# Altium project PCB_Project1.PrjPCB
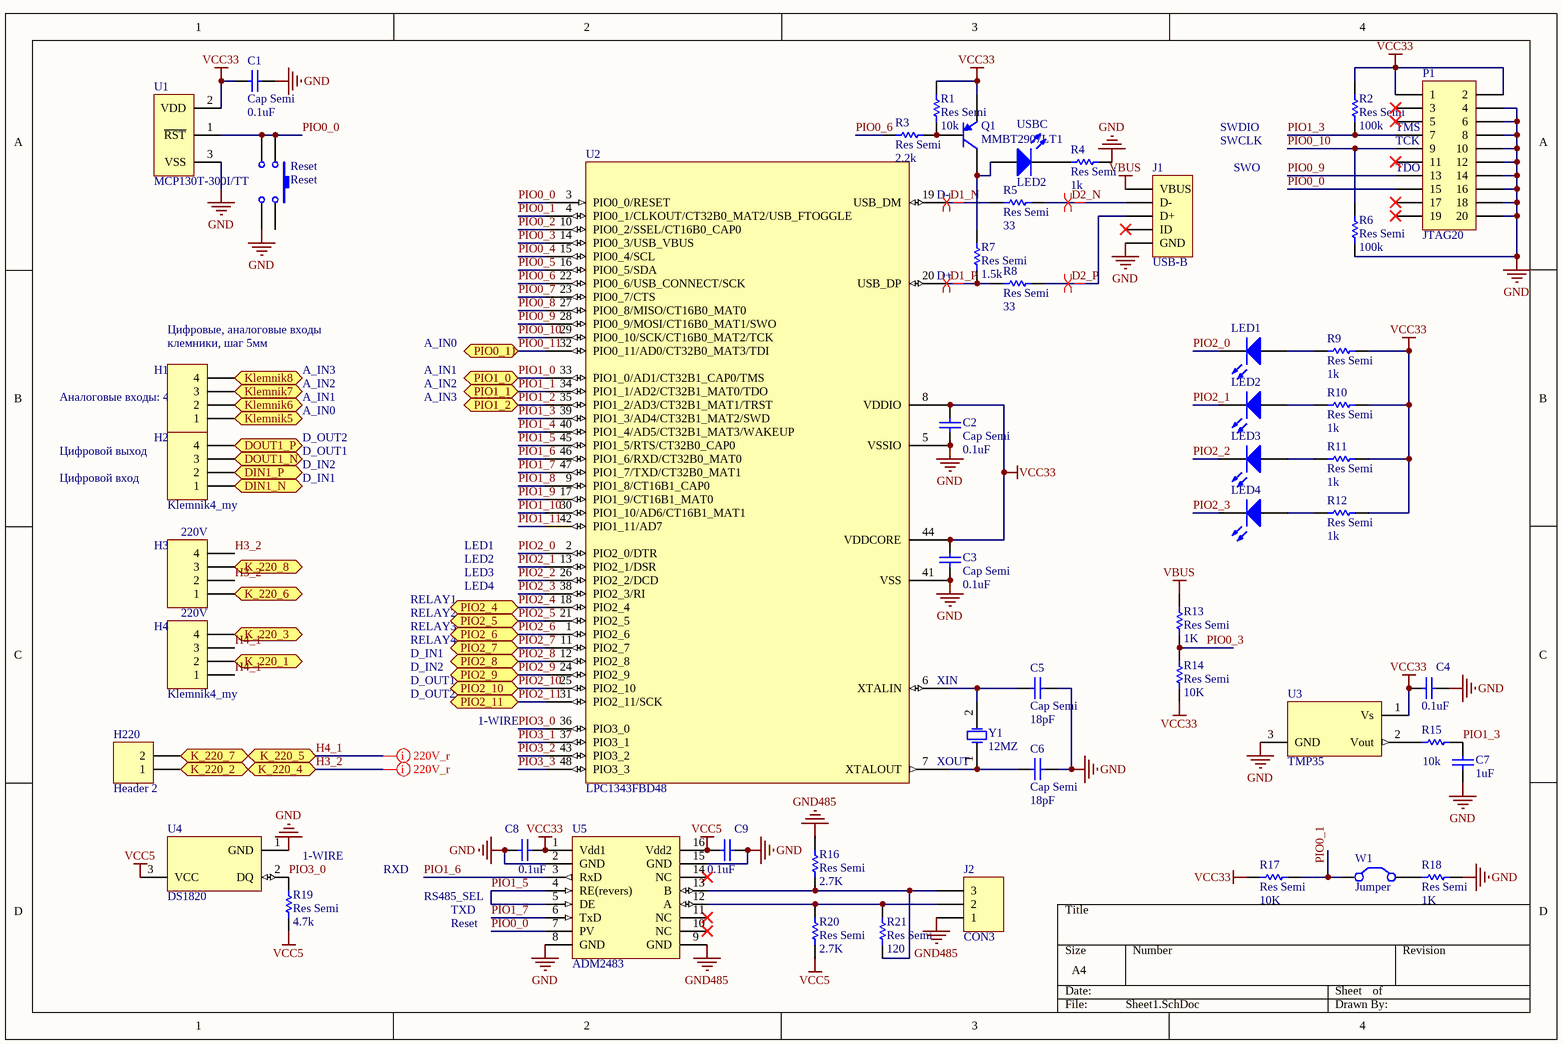
[diagram p0: Sheet1.SchDoc]
2 sheets, 99 parts. Net scope: flat (ports and power ports of the same name join across sheets).
Board files: PCB1.PcbDoc, PCB2.PcbDoc
Sheets:
  Sheet1.SchDoc
  Slave_Sheet2.SchDoc

## Sheet Sheet1.SchDoc
size A4

### Parts
C1  Cap Semi  value 0.1uF  [CAPC2012M]
C2  Cap Semi  value 0.1uF  [CAPC2012M]
C3  Cap Semi  value 0.1uF  [CAPC2012M]
C4  value 0.1uF  [CAPC2012M]  (hidden comment: Cap Semi)
C5  Cap Semi  value 18pF  [CAPC2012M]
C6  Cap Semi  value 18pF  [CAPC2012M]
C7  value 1uF  [CAPC2012M]  (hidden comment: Cap Semi)
C8  value 0.1uF  [CAPC2012M]  (hidden comment: Cap Semi)
C9  value 0.1uF  [CAPC2012M]  (hidden comment: Cap Semi)
H1  Klemnik4_my  [Klemnik4_5mm]  (value not drawn)
H2  Klemnik4_my  [Klemnik4_5mm]
H3  Klemnik4_my  [Klemnik4_5mm]  (value not drawn)
H4  Klemnik4_my  [Klemnik4_5mm]
H220  Header 2  [Klemnik2_5mm]
J1  USB-B  [MINI USB]
J2  CON3  [Klemnik3_5mm]
LED1  LED2  [CD3216-1206]  (value not drawn)
LED2  LED2  [CD3216-1206]  (value not drawn)
LED3  LED2  [CD3216-1206]  (value not drawn)
LED4  LED2  [CD3216-1206]  (value not drawn)
P1  JTAG20  [JTAG_SWD_2.54]
Q1  MMBT2907LT1  [SOT23_M]
R1  Res Semi  value 10k  [RESC2012M]
R2  Res Semi  value 100k  [RESC2012M]
R3  Res Semi  value 2.2k  [RESC2012M]
R4  Res Semi  value 1k  [RESC2012M]
R5  Res Semi  value 33  [RESC2012M]
R6  Res Semi  value 100k  [RESC2012M]
R7  Res Semi  value 1.5k  [RESC2012M]
R8  Res Semi  value 33  [RESC2012M]
R9  Res Semi  value 1k  [RESC2012M]
R10  Res Semi  value 1k  [RESC2012M]
R11  Res Semi  value 1k  [RESC2012M]
R12  Res Semi  value 1k  [RESC2012M]
R13  Res Semi  value 1K  [RESC2012M]
R14  Res Semi  value 10K  [RESC2012M]
R15  value 10k  [RESC2012M]  (hidden comment: Res Semi)
R16  Res Semi  value 2.7K  [RESC2012M]
R17  Res Semi  value 10K  [RESC2012M]
R18  Res Semi  value 1K  [RESC2012M]
R19  Res Semi  value 4.7k  [RESC2012M]
R20  Res Semi  value 2.7K  [RESC2012M]
R21  Res Semi  value 120  [RESC2012M]
Reset  Reset  [BUTTON]
U1  MCP130T-300I/TT  [SOT-23-TT3_N]
U2  LPC1343FBD48  [LQFP48_L]
U3  TMP35  [PR35]
U4  DS1820  [PR35]
U5  ADM2483  [SO16_N]
USBC  LED2  [CD3216-1206]
W1  Jumper  [HDR1X2]
Y1  12MZ  [HC-49SM]

### Ports
DIN1_N (bidir), DIN1_P (bidir), DOUT1_N (bidir), DOUT1_P (bidir), K_220_1 (bidir), K_220_2 (bidir), K_220_3 (bidir), K_220_4 (bidir), K_220_5 (bidir), K_220_6 (bidir), K_220_7 (bidir), K_220_8 (bidir), Klemnik5 (bidir), Klemnik6 (bidir), Klemnik7 (bidir), Klemnik8 (bidir), PIO0_11 (bidir), PIO1_0 (bidir), PIO1_1 (bidir), PIO1_2 (bidir), PIO2_4 (bidir), PIO2_5 (bidir), PIO2_6 (bidir), PIO2_7 (bidir), PIO2_8 (bidir), PIO2_9 (bidir), PIO2_10 (bidir), PIO2_11 (bidir)

### Nets
GND: C1.1 C2.1 C3.1 C4.1 C5.1 C6.1 C7.1 C8.2 C9.1 J1.5(GND) P1.4 P1.6 P1.8 P1.10 P1.12 P1.14 P1.16 P1.18 P1.20 R4.1 R6.2 R18.1 Reset.2 U1.3(VSS) U2.5(VSSIO) U2.41(VSS) U3.3(GND) U4.1(GND) U5.2(GND) U5.8(GND) U5.15(GND)
GND485: J2.1 R16.2 U5.9(GND)
VBUS: J1.1(VBUS) R13.2
VCC5: C9.2 R19.2 R20.1 U4.3(VCC) U5.16(Vdd2)
VCC33: C1.2 C2.2 C3.2 C4.2 C8.1 P1.1 P1.2 Q1.2(E) R1.2 R2.1 R9.1 R10.1 R11.2 R12.1 R14.1 R17.2 U1.2(VDD) U2.8(VDDIO) U2.44(VDDCORE) U3.1(Vs) U5.1(Vdd1)
D1_N: R5.1 U2.19(USB_DM)
D1_P: R7.1 R8.1 U2.20(USB_DP)
D2_N: J1.2(D-) R5.2
D2_P: J1.3(D+) R8.2
H3_2: H3.2 H3.4 H220.1 ; port K_220_4, port K_220_2
H4_1: H4.1 H4.3 H220.2 ; port K_220_5, port K_220_7
PIO0_0: P1.15 Reset.3 Reset.4 U1.1(~{RST}) U2.3(PIO0_0/RESET) U5.7(PV)
PIO0_1: R17.1 U2.4(PIO0_1/CLKOUT/CT32B0_MAT2/USB_FTOGGLE) W1.1(C1)
PIO0_2: U2.10(PIO0_2/SSEL/CT16B0_CAP0)
PIO0_3: R13.1 R14.2 U2.14(PIO0_3/USB_VBUS)
PIO0_4: U2.15(PIO0_4/SCL)
PIO0_5: U2.16(PIO0_5/SDA)
PIO0_6: R3.2 U2.22(PIO0_6/USB_CONNECT/SCK)
PIO0_7: U2.23(PIO0_7/CTS)
PIO0_8: U2.27(PIO0_8/MISO/CT16B0_MAT0)
PIO0_9: P1.13 U2.28(PIO0_9/MOSI/CT16B0_MAT1/SWO)
PIO0_10: P1.9 R6.1 U2.29(PIO0_10/SCK/CT16B0_MAT2/TCK)
PIO0_11: U2.32(PIO0_11/AD0/CT32B0_MAT3/TDI) ; port PIO0_11
PIO1_0: U2.33(PIO1_0/AD1/CT32B1_CAP0/TMS) ; port PIO1_0
PIO1_1: U2.34(PIO1_1/AD2/CT32B1_MAT0/TDO) ; port PIO1_1
PIO1_2: U2.35(PIO1_2/AD3/CT32B1_MAT1/TRST) ; port PIO1_2
PIO1_3: C7.2 P1.7 R2.2 R15.1 U2.39(PIO1_3/AD4/CT32B1_MAT2/SWD)
PIO1_4: U2.40(PIO1_4/AD5/CT32B1_MAT3/WAKEUP)
PIO1_5: U2.45(PIO1_5/RTS/CT32B0_CAP0) U5.4(RE(revers)) U5.5(DE)
PIO1_6: U2.46(PIO1_6/RXD/CT32B0_MAT0) U5.3(RxD)
PIO1_7: U2.47(PIO1_7/TXD/CT32B0_MAT1) U5.6(TxD)
PIO1_8: U2.9(PIO1_8/CT16B1_CAP0)
PIO1_9: U2.17(PIO1_9/CT16B1_MAT0)
PIO1_10: U2.30(PIO1_10/AD6/CT16B1_MAT1)
PIO1_11: U2.42(PIO1_11/AD7)
PIO2_0: LED1.2(K) U2.2(PIO2_0/DTR)
PIO2_1: LED2.2(K) U2.13(PIO2_1/DSR)
PIO2_2: LED3.2(K) U2.26(PIO2_2/DCD)
PIO2_3: LED4.2(K) U2.38(PIO2_3/RI)
PIO2_4: U2.18(PIO2_4) ; port PIO2_4
PIO2_5: U2.21(PIO2_5) ; port PIO2_5
PIO2_6: U2.1(PIO2_6) ; port PIO2_6
PIO2_7: U2.11(PIO2_7) ; port PIO2_7
PIO2_8: U2.12(PIO2_8) ; port PIO2_8
PIO2_9: U2.24(PIO2_9) ; port PIO2_9
PIO2_10: U2.25(PIO2_10) ; port PIO2_10
PIO2_11: U2.31(PIO2_11/SCK) ; port PIO2_11
PIO3_0: R19.1 U2.36(PIO3_0) U4.2(DQ)
PIO3_1: U2.37(PIO3_1)
PIO3_2: U2.43(PIO3_2)
PIO3_3: U2.48(PIO3_3)
NetC5_2: C5.2 U2.6(XTALIN) Y1.2(OSC2)
NetC6_2: C6.2 U2.7(XTALOUT) Y1.1(OSC1)
NetH1_1: H1.1 ; port Klemnik5
NetH1_2: H1.2 ; port Klemnik6
NetH1_3: H1.3 ; port Klemnik7
NetH1_4: H1.4 ; port Klemnik8
NetH2_1: H2.1 ; port DIN1_N
NetH2_2: H2.2 ; port DIN1_P
NetH2_3: H2.3 ; port DOUT1_N
NetH2_4: H2.4 ; port DOUT1_P
NetH3_1: H3.1 ; port K_220_6
NetH3_3: H3.3 ; port K_220_8
NetH4_2: H4.2 ; port K_220_1
NetH4_4: H4.4 ; port K_220_3
NetJ2_2: J2.2 R20.2 R21.2 U5.12(A)
NetJ2_3: J2.3 R16.1 R21.1 U5.13(B)
NetLED1_1: LED1.1(A) R9.2
NetLED2_1: LED2.1(A) R10.2
NetLED3_1: LED3.1(A) R11.1
NetLED4_1: LED4.1(A) R12.2
NetQ1_1: Q1.1(B) R1.1 R3.1
NetQ1_3: Q1.3(C) R7.2 USBC.1(A)
NetR4_2: R4.2 USBC.2(K)
NetR15_2: R15.2 U3.2(Vout)
NetR18_2: R18.2 W1.2(C2)

Not connected (* = marked no-connect by the designer): J1 4(ID)*; P1 3* 5* 11* 17* 19*; Reset 1; U5 10(NC)* 11(NC)* 14(NC)*

### Layout directives
differential pair: D1_N, D1_P, D2_N, D2_P
net class 220V_r: H3_2, H4_1

### Notes on the sheet
- SWDIO
- SWCLK
- SWO
- (near P1) TMS
- (near P1) TCK
- (near P1) TDO
- D-
- D+
- (near H1) клемники, шаг 5мм
- (near H1) Цифровые, аналоговые входы
- A_IN2
- A_IN3
- A_IN1
- A_IN0
- Аналоговые входы: 4
- Цифровой выход
- D_OUT1
- D_OUT2
- Цифровой вход
- D_IN1
- D_IN2
- (near H3) 220V
- LED4
- LED1
- LED2
- LED3
- 220V
- RELAY1
- RELAY2
- RELAY3
- RELAY4
- 1-WIRE
- (near U2) XIN
- XOUT
- RXD
- RS485_SEL
- TXD
- Reset

### Library data of the parts
C1-C9 = Cap Semi: Capacitor (Semiconductor SIM Model); Published: 8-Jun-2000; LatestRevisionDate: 29-May-2009; LatestRevisionNote: IPC-7351 Footprint Added.; PackageReference: C1206; Publisher: Altium Limited; PackageDescription: Chip Capacitor
H1-H4 = Klemnik4_my: Header, 4-Pin, 300-041-12; LatestRevisionDate: 17-Jul-2002; LatestRevisionNote: Re-released for DXP Platform.; Publisher: Altium Limited
H220 = Header 2: Header, 2-Pin; LatestRevisionDate: 17-Jul-2002; LatestRevisionNote: Re-released for DXP Platform.; Publisher: Altium Limited
J1 = USB connector 5: USB connector, 5-Pin; LatestRevisionDate: 17-Jul-2002; LatestRevisionNote: Re-released for DXP Platform.; Publisher: Altium Limited
J2 = RS485 Klemnik 3: Header, 3-Pin; LatestRevisionDate: 17-Jul-2002; LatestRevisionNote: Re-released for DXP Platform.; Publisher: Altium Limited
LED1-LED4 USBC = LED2: Typical RED, GREEN, YELLOW, AMBER GaAs LED; Published: 8-Jun-2000; LatestRevisionDate: 17-Jul-2002; LatestRevisionNote: Re-released for DXP Platform.; PackageVersion: Feb-2002; PackageReference: 3.2X1.6X1.1; Publisher: Altium Limited
P1 = Header 10X2: Header, 10-Pin, Dual row; LatestRevisionDate: 17-Jul-2002; LatestRevisionNote: Re-released for DXP Platform.; Publisher: Altium Limited
Q1 = MMBT2907LT1: General Purpose Transistor PNP Silicon; Published: 29-Sep-2000; LatestRevisionDate: 17-Jul-2002; LatestRevisionNote: Re-released for DXP Platform.; DatasheetVersion: 1996; PackageVersion: 1997; PackageReference: 318-08; Publisher: Altium Limited; PackageDescription: SOT-23; 3 Leads; Body 3.0 x 2.6 mm, inc. leads (LxW max); ComponentLink1Description: Manufacturer Link; ComponentLink1URL: http://www.onsemi.com/site/products/landing?taxonomyID=194
R1-R21 = Res Semi: Semiconductor Resistor; Published: 8-Jun-2000; LatestRevisionDate: 17-Jul-2002; LatestRevisionNote: Re-released for DXP Platform.; PackageReference: AXIAL-0.5; Publisher: Altium Limited
Reset = BUTTON: DTSGL-61M; Published: 24-Mar-1999; LatestRevisionDate: 17-Jul-2002; LatestRevisionNote: Re-released for DXP Platform.; PackageReference: SPST-2; Publisher: Altium Limited; MODEL: DTSGL-61M
U1 = MCP130T-300I/TT: Microcontroller Supervisory Circuit with Open Drain Output, 3-Pin SOT-23, Industrial Temperature, Tape and Reel; FirstPublished: 29-Jan-2009; DatasheetVersion: revD, 2001; PackageVersion: revBB, Aug-2009; PackageReference: SOT-23-TT3; Publisher: Altium Limited; PackageDescription: 3-Lead Plastic Small Outline Transistor (TT) [SOT-23]; Supplier 1: Digi-Key; Supplier Part Number 1: MCP130T-450I/TTTR-ND; Supplier 2: Digi-Key; Supplier Part Number 2: MCP130T-450I/TTCT-ND; Supplier 3: Digi-Key; Supplier Part Number 3: MCP130T-450I/TTDKR-ND; Supplier 4: Farnell; Supplier Part Number 4: 9758488; Supplier 5: Farnell; Supplier Part Number 5: 4882763; Supplier 6: Newark; Supplier Part Number 6: 19C7180; Code_IPC: SOT23-3; ComponentLink1Description: Datasheet; ComponentLink1URL: http://ww1.microchip.com/downloads/en/DeviceDoc/11184d.pdf; ComponentLink2Description: Packaging Specification; ComponentLink2URL: http://www.microchip.com/stellent/groups/techpub_sg/documents/packagingspec/en012702.pdf; ComponentLink3Description: Microchip.com Home; ComponentLink3URL: http://www.microchip.com/
U2 = LPC1343FBD48: ARM-based 32-bit MCU with 64 Kbytes Flash, 48-pin LQFP, Industrial Temperature; Published: 30-May-2008; DatasheetVersion: rev6, Mar-2008; PackageVersion: Mar-2008; PackageReference: LQFP48; Publisher: Altium Limited; PackageDescription: 48-Pin Low-Profile Quad Flat Pack, 7 x 7 mm Body, 0.5 mm Pitch (LQFP48); ComponentLink1Description: Manufacturer Link; ComponentLink1URL: www.st.com/stm32; ComponentLink2Description: Datasheet; ComponentLink2URL: http://www.st.com/stonline/products/literature/ds/13587.pdf
U3 = TMP35: ComponentAvailability: Obsolete; Published: 13-Oct-2000; LatestRevisionDate: 17-Jul-2002; LatestRevisionNote: Re-released for DXP Platform.; DatasheetVersion: 5-Mar-1998; PackageVersion: 1999; PackageReference: PR35; Publisher: Altium Limited; PackageDescription: TO, Flat Index; 3 In-Line, Axial Leads; Body Dia. 4.6mm; Leads 0.56 x 0.51 mm (max); ComponentLink1Description: Manufacturer Link; ComponentLink1URL: http://www.maxim-ic.com/; ComponentLink2Description: Datasheet; ComponentLink2URL: http://pdfserv.maxim-ic.com/en/ds/DS1820-DS1820S.pdf; ComponentLink3Description: Discontinuation Notice; ComponentLink3URL: http://www.maxim-ic.com/qa/pdfs/non-obsolescence-letter.pdf
U4 = DS1820: 1-Wire Digital Thermometer; ComponentAvailability: Obsolete; Published: 13-Oct-2000; LatestRevisionDate: 17-Jul-2002; LatestRevisionNote: Re-released for DXP Platform.; DatasheetVersion: 5-Mar-1998; PackageVersion: 1999; PackageReference: PR35; Publisher: Altium Limited; PackageDescription: TO, Flat Index; 3 In-Line, Axial Leads; Body Dia. 4.6mm; Leads 0.56 x 0.51 mm (max); ComponentLink1Description: Manufacturer Link; ComponentLink1URL: http://www.maxim-ic.com/; ComponentLink2Description: Datasheet; ComponentLink2URL: http://pdfserv.maxim-ic.com/en/ds/DS1820-DS1820S.pdf; ComponentLink3Description: Discontinuation Notice; ComponentLink3URL: http://www.maxim-ic.com/qa/pdfs/non-obsolescence-letter.pdf
U5 = ADM2483: isolated rs-485 driver; Published: 24-Aug-2001; LatestRevisionDate: 13-Apr-2006; LatestRevisionNote: IPC-7351 Footprint Added.; DatasheetVersion: Nov-1997; PackageVersion: May-1998; PackageReference: SO16; Publisher: Altium Limited; PackageDescription: 16-Pin Small Outline Integrated Circuit 1.27 mm Pitch; Code_IPC: SOIC127P600-16; ComponentLink1Description: Manufacturer Link; ComponentLink1URL: http://www.st.com/; ComponentLink2Description: Datasheet; ComponentLink2URL: http://www.st.com/stonline/products/literature/ds/2160/lm346.pdf
W1 = Jumper: Jumper Wire; Published: 24-Mar-1999; LatestRevisionDate: 17-Jul-2002; LatestRevisionNote: Re-released for DXP Platform.; PackageReference: RAD-0.2; Publisher: Altium Limited
Y1 = XTAL: Crystal Oscillator; Published: 8-Jun-2000; LatestRevisionDate: 17-Jul-2002; LatestRevisionNote: Re-released for DXP Platform.; PackageReference: R38; Publisher: Altium Limited

## Sheet Slave_Sheet2.SchDoc
size A4
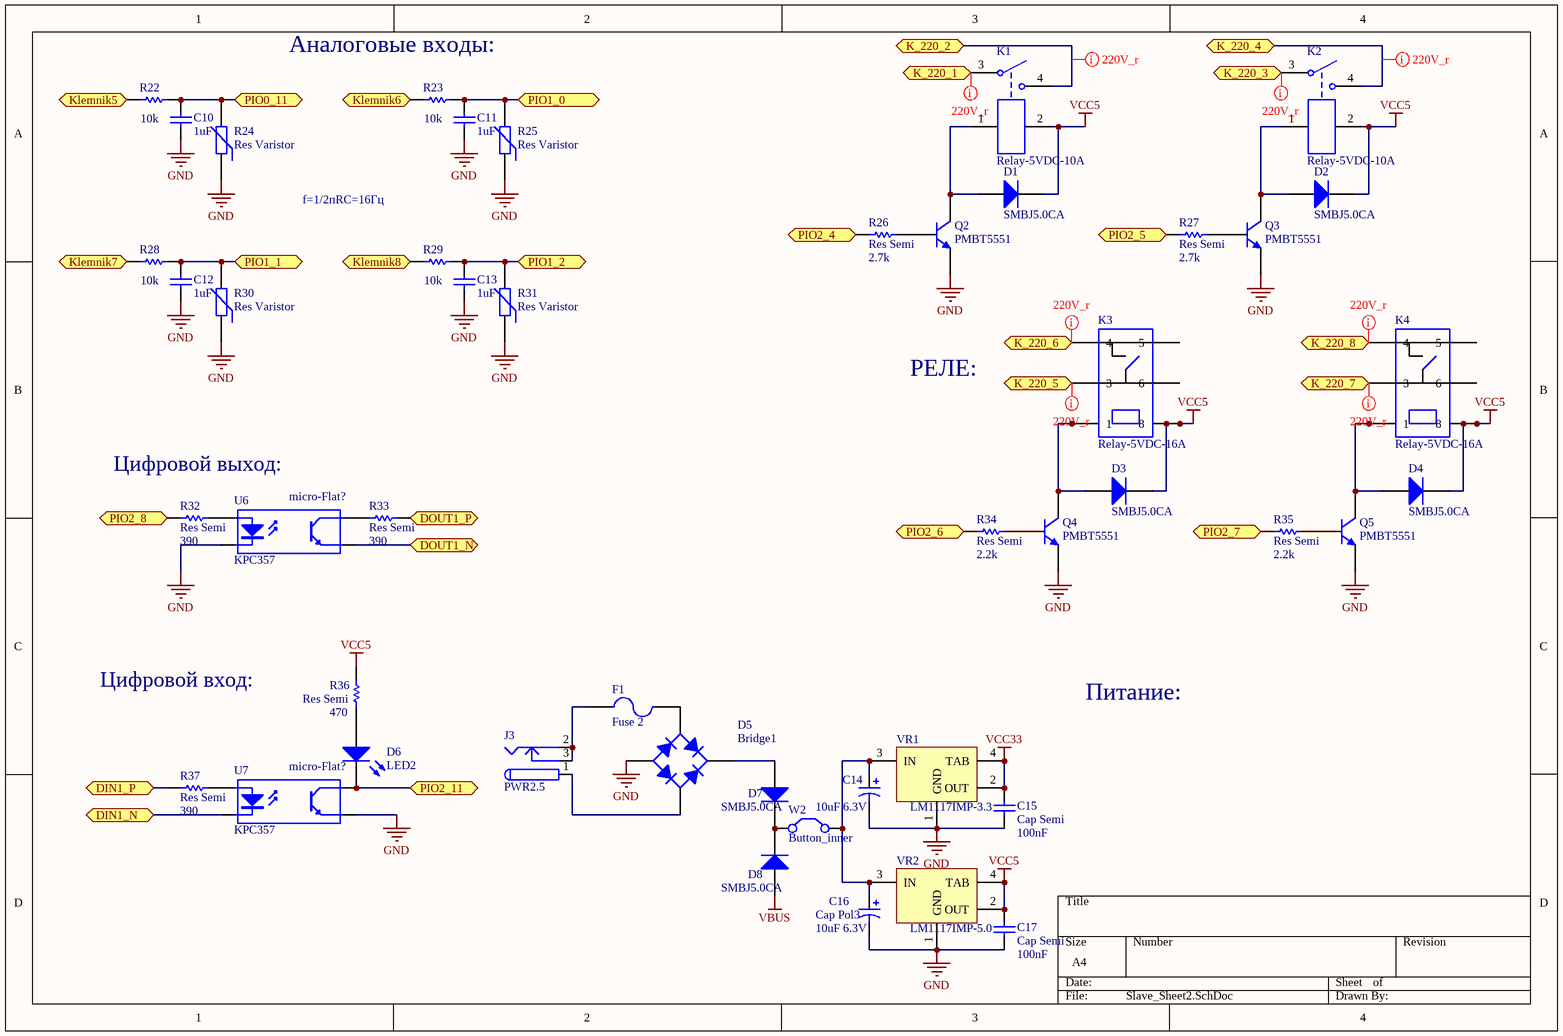
[diagram p1: Slave_Sheet2.SchDoc]

### Parts
C10  value 1uF  [CAPC2012M]  (hidden comment: Cap Semi)
C11  value 1uF  [CAPC2012M]  (hidden comment: Cap Semi)
C12  value 1uF  [CAPC2012M]  (hidden comment: Cap Semi)
C13  value 1uF  [CAPC2012M]  (hidden comment: Cap Semi)
C14  value 10uF 6.3V  [CAPC4532L]  (hidden comment: Cap Pol3)
C15  Cap Semi  value 100nF  [CAPC2012M]
C16  Cap Pol3  value 10uF 6.3V  [CAPC4532L]
C17  Cap Semi  value 100nF  [CAPC2012M]
D1  SMBJ5.0CA  [SMB]
D2  SMBJ5.0CA  [SMB]
D3  SMBJ5.0CA  [SMB]
D4  SMBJ5.0CA  [SMB]
D5  Bridge1  [DB-1S]
D6  LED2  [CD3216-1206]
D7  SMBJ5.0CA  [SMB]
D8  SMBJ5.0CA  [SMB]
F1  Fuse 2  [CD4532-1812]
J3  PWR2.5  [KLD-0202]
K1  Relay-5VDC-10A  [TRCF-SB]
K2  Relay-5VDC-10A  [TRCF-SB]
K3  Relay-5VDC-16A  [TRIH-AE]
K4  Relay-5VDC-16A  [TRIH-AE]
Q2  PMBT5551  [SOT23_M]
Q3  PMBT5551  [SOT23_M]
Q4  PMBT5551  [SOT23_M]
Q5  PMBT5551  [SOT23_M]
R22  value 10k  [RESC2012M]  (hidden comment: Res Semi)
R23  value 10k  [RESC2012M]  (hidden comment: Res Semi)
R24  Res Varistor  [RESC3216L]
R25  Res Varistor  [RESC3216L]
R26  Res Semi  value 2.7k  [RESC2012M]
R27  Res Semi  value 2.7k  [RESC2012M]
R28  value 10k  [RESC2012M]  (hidden comment: Res Semi)
R29  value 10k  [RESC2012M]  (hidden comment: Res Semi)
R30  Res Varistor  [RESC3216L]
R31  Res Varistor  [RESC3216L]
R32  Res Semi  value 390  [RESC2012M]
R33  Res Semi  value 390  [RESC2012M]
R34  Res Semi  value 2.2k  [RESC2012M]
R35  Res Semi  value 2.2k  [RESC2012M]
R36  Res Semi  value 470  [RESC2012M]
R37  Res Semi  value 390  [RESC2012M]
U6  KPC357  [Micro-Flat]
U7  KPC357  [Micro-Flat]
VR1  LM1117IMP-3.3  [MP04A_N]
VR2  LM1117IMP-5.0  [MP04A_N]
W2  Button_inner  [HDR1X2]

### Ports
DIN1_N (bidir), DIN1_P (bidir), DOUT1_N (bidir), DOUT1_P (bidir), K_220_1 (bidir), K_220_2 (bidir), K_220_3 (bidir), K_220_4 (bidir), K_220_5 (bidir), K_220_6 (bidir), K_220_7 (bidir), K_220_8 (bidir), Klemnik5 (bidir), Klemnik6 (bidir), Klemnik7 (bidir), Klemnik8 (bidir), PIO0_11 (bidir), PIO1_0 (bidir), PIO1_1 (bidir), PIO1_2 (bidir), PIO2_4 (bidir), PIO2_5 (bidir), PIO2_6 (bidir), PIO2_7 (bidir), PIO2_8 (bidir), PIO2_11 (bidir)

### Nets
GND: C10.1 C11.1 C12.1 C13.1 C14.2 C15.1 C16.2 C17.1 D5.3(A) Q2.2(E) Q3.2(E) Q4.2(E) Q5.2(E) R24.1 R25.1 R30.1 R31.1 U6.2(K) U7.3(E) VR1.1(GND) VR2.1(GND)
VBUS: D8.1(A)
VCC5: C17.2 D1.2(K) D2.2(K) D3.2(K) D4.2(K) K1.2 K2.2 K3.8 K4.8 R36.1 VR2.2(OUT) VR2.4(TAB)
VCC33: C15.2 VR1.2(OUT) VR1.4(TAB)
H3_2: K1.4 K2.4 ; port K_220_4, port K_220_2
H4_1: K3.3 K4.3 ; port K_220_5, port K_220_7
PIO0_11: C10.2 R22.1 R24.2 ; port PIO0_11
PIO1_0: C11.2 R23.1 R25.2 ; port PIO1_0
PIO1_1: C12.2 R28.1 R30.2 ; port PIO1_1
PIO1_2: C13.2 R29.1 R31.2 ; port PIO1_2
PIO2_4: R26.2 ; port PIO2_4
PIO2_5: R27.2 ; port PIO2_5
PIO2_6: R34.2 ; port PIO2_6
PIO2_7: R35.2 ; port PIO2_7
PIO2_8: R32.2 ; port PIO2_8
PIO2_11: D6.2(K) U7.4(C) ; port PIO2_11
NetC14_1: C14.1 C16.1 VR1.3(IN) VR2.3(IN) W2.2(C2)
NetD1_1: D1.1(A) K1.1 Q2.3(C)
NetD2_1: D2.1(A) K2.1 Q3.3(C)
NetD3_1: D3.1(A) K3.1 Q4.3(C)
NetD4_1: D4.1(A) K4.1 Q5.3(C)
NetD5_1: D5.1(K) D7.1(A)
NetD5_2: D5.2(C) J3.1
NetD5_4: D5.4(C) F1.2
NetD6_1: D6.1(A) R36.2
NetD7_2: D7.2(K) D8.2(K) W2.1(C1)
NetF1_1: F1.1 J3.2 J3.3
NetH1_1: R22.2 ; port Klemnik5
NetH1_2: R23.2 ; port Klemnik6
NetH1_3: R28.2 ; port Klemnik7
NetH1_4: R29.2 ; port Klemnik8
NetH2_1: U7.2(K) ; port DIN1_N
NetH2_2: R37.2 ; port DIN1_P
NetH2_3: U6.3(E) ; port DOUT1_N
NetH2_4: R33.1 ; port DOUT1_P
NetH3_1: K3.4 ; port K_220_6
NetH3_3: K4.4 ; port K_220_8
NetH4_2: K1.3 ; port K_220_1
NetH4_4: K2.3 ; port K_220_3
NetQ2_1: Q2.1(B) R26.1
NetQ3_1: Q3.1(B) R27.1
NetQ4_1: Q4.1(B) R34.1
NetQ5_1: Q5.1(B) R35.1
NetR32_1: R32.1 U6.1(A)
NetR33_2: R33.2 U6.4(C)
NetR37_1: R37.1 U7.1(A)

Not connected (* = marked no-connect by the designer): K3 5 6; K4 5 6

### Layout directives
net class 220V_r: H3_2, H4_1, NetH3_1, NetH3_3, NetH4_2, NetH4_4

### Notes on the sheet
- Аналоговые входы:
- f=1/2пRC=16Гц
- РЕЛЕ:
- Цифровой выход:
- micro-Flat?
- Цифровой вход:
- Питание:
- (near D6) micro-Flat?

### Library data of the parts
C10-C13 C15 C17 = Cap Semi: Capacitor (Semiconductor SIM Model); Published: 8-Jun-2000; LatestRevisionDate: 29-May-2009; LatestRevisionNote: IPC-7351 Footprint Added.; PackageReference: C1206; Publisher: Altium Limited; PackageDescription: Chip Capacitor
C14 C16 = Cap Pol3: Polarized Capacitor (Surface Mount); Published: 8-Jun-2000; LatestRevisionDate: 29-May-2009; LatestRevisionNote: IPC-7351 Footprint Added.; PackageReference: C0805; Publisher: Altium Limited; PackageDescription: Chip Capacitor
D1-D4 D7 D8 = Diode 1N4007: 1 Amp General Purpose Rectifier; Published: 8-Jun-2000; LatestRevisionDate: 17-Jul-2002; LatestRevisionNote: Re-released for DXP Platform.; DatasheetDocument: 1998; PackageDocument: Aug-1999; PackageReference: DO-41; Publisher: Altium Limited; Code_JEDEC: DO-204-AL; ComponentLink1Description: Manufacturer Link; ComponentLink1URL: http://www.fairchildsemi.com/; ComponentLink2Description: Datasheet; ComponentLink2URL: http://www.fairchildsemi.com/ds/1N%2F1N4001.pdf
D5 = Bridge1: Full Wave Diode Bridge; Published: 8-Jun-2000; LatestRevisionDate: 29-May-2009; LatestRevisionNote: Sch pins A & K swapped.; DatasheetVersion: E2732B; PackageReference: D-38; Publisher: Altium Limited
D6 = LED2: as LED1 on sheet Sheet1; Published: 8-Jun-2000; LatestRevisionDate: 17-Jul-2002; LatestRevisionNote: Re-released for DXP Platform.; PackageVersion: Feb-2002; PackageReference: 3.2X1.6X1.1; Publisher: Altium Limited
F1 = Fuse 2: Fuse; Published: 8-Jun-2000; LatestRevisionDate: 17-Jul-2002; LatestRevisionNote: Re-released for DXP Platform.; PackageReference: PIN-W2/E2.8; Publisher: Altium Limited
J3 = PWR2.5: Low Voltage Power Supply Connector; Published: 17-Dec-2003; DatasheetDocument: 09-May-2002; Publisher: Altium Limited; ComponentLink1Description: Manufacturer Link; ComponentLink1URL: http://domino.kycon.com/internet/Products.html
K1 K2 = Relay-5VDC-10A: TRCF-5VDC-SB-A; Published: 24-Mar-1999; LatestRevisionDate: 17-Jul-2002; LatestRevisionNote: Re-released for DXP Platform.; PackageReference: MODULE5B; Publisher: Altium Limited; MODEL: TRCF-5VDC-SB-A
K3 K4 = Relay-5VDC-16A: TRIH-5VDC-SD-1AE-R; Published: 24-Mar-1999; LatestRevisionDate: 17-Jul-2002; LatestRevisionNote: Re-released for DXP Platform.; PackageReference: MODULE5B; Publisher: Altium Limited; MODEL: TRIH-5VDC-SD-1AE-R
Q2-Q5 = PMBT5551: NPN Switching Transistor; Published: 17-Sep-2003; LatestRevisionDate: 12-Dec-2006; LatestRevisionNote: IPC-7351 Footprint Added.; DatasheetVersion: 13-May-2002; PackageVersion: May-1999; PackageReference: SOT23; Publisher: Altium Limited; PackageDescription: 3-Pin SOT-23 Package 0.95 mm Pitch, 2.3 mm Lead Span; ComponentLink1Description: Manufacturer Link; ComponentLink1URL: http://www.semiconductors.philips.com/; ComponentLink2Description: Datasheet; ComponentLink2URL: http://www.semiconductors.philips.com/acrobat/datasheets/MMBT3904_4.pdf
R22 R23 R26-R29 R32-R37 = Res Semi: Semiconductor Resistor; Published: 8-Jun-2000; LatestRevisionDate: 17-Jul-2002; LatestRevisionNote: Re-released for DXP Platform.; PackageReference: AXIAL-0.5; Publisher: Altium Limited
R24 R25 R30 R31 = Res Varistor: Varistor (Voltage-Sensitive Resistor); Published: 24-Mar-1999; LatestRevisionDate: 29-May-2009; LatestRevisionNote: IPC-7351 Footprint Added.; PackageVersion: Mar-2003; PackageReference: 6-0805; Publisher: Altium Limited; PackageDescription: Chip Resistor 0805 Case Size; Code_IPC: RESC2012
U6 U7 = Optoisolator1: 4-Pin Phototransistor Optocoupler; Published: 24-Mar-1999; LatestRevisionDate: 04-Mar-2005; LatestRevisionNote: Sch pins 3 & 4 Swapped.; DatasheetVersion: Nov-2003; PackageReference: DIP-4; Publisher: Altium Limited
VR1 = LM1117IMP-3.3: 800mA Low-Dropout Linear Regulator; Manufacturer: National Semiconductor; CompType: LDO IC; PackageTopMarking: XYTT*N05B; PowerWise: N; Published: 4-Dec-2008; DatasheetVersion: Apr-2006; PackageVersion: revB, Apr-2003; PackageReference: MP04A; Publisher: Altium Limited; PackageDescription: Molded SOT-223, 6.50 x 3.56 x 1.6mm Body, 4 Lead, 2.3mm Pitch; PartNumber: LM1117IMP-3.3; RoHS: O; PinCount: 4; DigiKeyPartNumber: LM1117IMP-3.3CT-ND; Code_JEDEC: TO-261-AA; Code_IPC: SOT223-4; ComponentLink1Description: LM1117 Datasheet; ComponentLink1URL: http://www.national.com/ds/LM/LM1117.pdf; ComponentLink2Description: LM1117 Web Page; ComponentLink2URL: http://www.national.com/pf/LM/LM1117.html; ComponentLink3Description: MP04A Package Page; ComponentLink3URL: http://www.national.com/packaging/folders/mp04a.html
VR2 = LM1117IMP-5.0: 800mA Low-Dropout Linear Regulator; Manufacturer: National Semiconductor; CompType: LDO IC; PackageTopMarking: XYTT*N06B; PowerWise: N; Published: 4-Dec-2008; DatasheetVersion: Apr-2006; PackageVersion: revB, Apr-2003; PackageReference: MP04A; Publisher: Altium Limited; PackageDescription: Molded SOT-223, 6.50 x 3.56 x 1.6mm Body, 4 Lead, 2.3mm Pitch; PartNumber: LM1117IMP-5.0; RoHS: O; PinCount: 4; DigiKeyPartNumber: LM1117IMP-5.0CT-ND; Code_JEDEC: TO-261-AA; Code_IPC: SOT223-4; ComponentLink1Description: LM1117 Datasheet; ComponentLink1URL: http://www.national.com/ds/LM/LM1117.pdf; ComponentLink2Description: LM1117 Web Page; ComponentLink2URL: http://www.national.com/pf/LM/LM1117.html; ComponentLink3Description: MP04A Package Page; ComponentLink3URL: http://www.national.com/packaging/folders/mp04a.html
W2 = Button_inner: Power Button; Published: 24-Mar-1999; LatestRevisionDate: 17-Jul-2002; LatestRevisionNote: Re-released for DXP Platform.; PackageReference: RAD-0.2; Publisher: Altium Limited

## Nets that join several sheets
GND: Sheet1 (31 pins), Slave_Sheet2 (21 pins)
VBUS: Sheet1 (J1.1 R13.2), Slave_Sheet2 (D8.1)
VCC5: Sheet1 (5 pins), Slave_Sheet2 (12 pins)
VCC33: Sheet1 (21 pins), Slave_Sheet2 (C15.2 VR1.2 VR1.4)
H3_2: Sheet1 (H3.2 H3.4 H220.1), Slave_Sheet2 (K1.4 K2.4)
H4_1: Sheet1 (H4.1 H4.3 H220.2), Slave_Sheet2 (K3.3 K4.3)
NetH1_1: Sheet1 (H1.1), Slave_Sheet2 (R22.2)
NetH1_2: Sheet1 (H1.2), Slave_Sheet2 (R23.2)
NetH1_3: Sheet1 (H1.3), Slave_Sheet2 (R28.2)
NetH1_4: Sheet1 (H1.4), Slave_Sheet2 (R29.2)
NetH2_1: Sheet1 (H2.1), Slave_Sheet2 (U7.2)
NetH2_2: Sheet1 (H2.2), Slave_Sheet2 (R37.2)
NetH2_3: Sheet1 (H2.3), Slave_Sheet2 (U6.3)
NetH2_4: Sheet1 (H2.4), Slave_Sheet2 (R33.1)
NetH3_1: Sheet1 (H3.1), Slave_Sheet2 (K3.4)
NetH3_3: Sheet1 (H3.3), Slave_Sheet2 (K4.4)
NetH4_2: Sheet1 (H4.2), Slave_Sheet2 (K1.3)
NetH4_4: Sheet1 (H4.4), Slave_Sheet2 (K2.3)
PIO0_11: Sheet1 (U2.32), Slave_Sheet2 (C10.2 R22.1 R24.2)
PIO1_0: Sheet1 (U2.33), Slave_Sheet2 (C11.2 R23.1 R25.2)
PIO1_1: Sheet1 (U2.34), Slave_Sheet2 (C12.2 R28.1 R30.2)
PIO1_2: Sheet1 (U2.35), Slave_Sheet2 (C13.2 R29.1 R31.2)
PIO2_4: Sheet1 (U2.18), Slave_Sheet2 (R26.2)
PIO2_5: Sheet1 (U2.21), Slave_Sheet2 (R27.2)
PIO2_6: Sheet1 (U2.1), Slave_Sheet2 (R34.2)
PIO2_7: Sheet1 (U2.11), Slave_Sheet2 (R35.2)
PIO2_8: Sheet1 (U2.12), Slave_Sheet2 (R32.2)
PIO2_11: Sheet1 (U2.31), Slave_Sheet2 (D6.2 U7.4)

## Assembly variants
Variant of PCB_Project1: all parts fitted